# Altium project PM06-底层中央板.PrjPcb
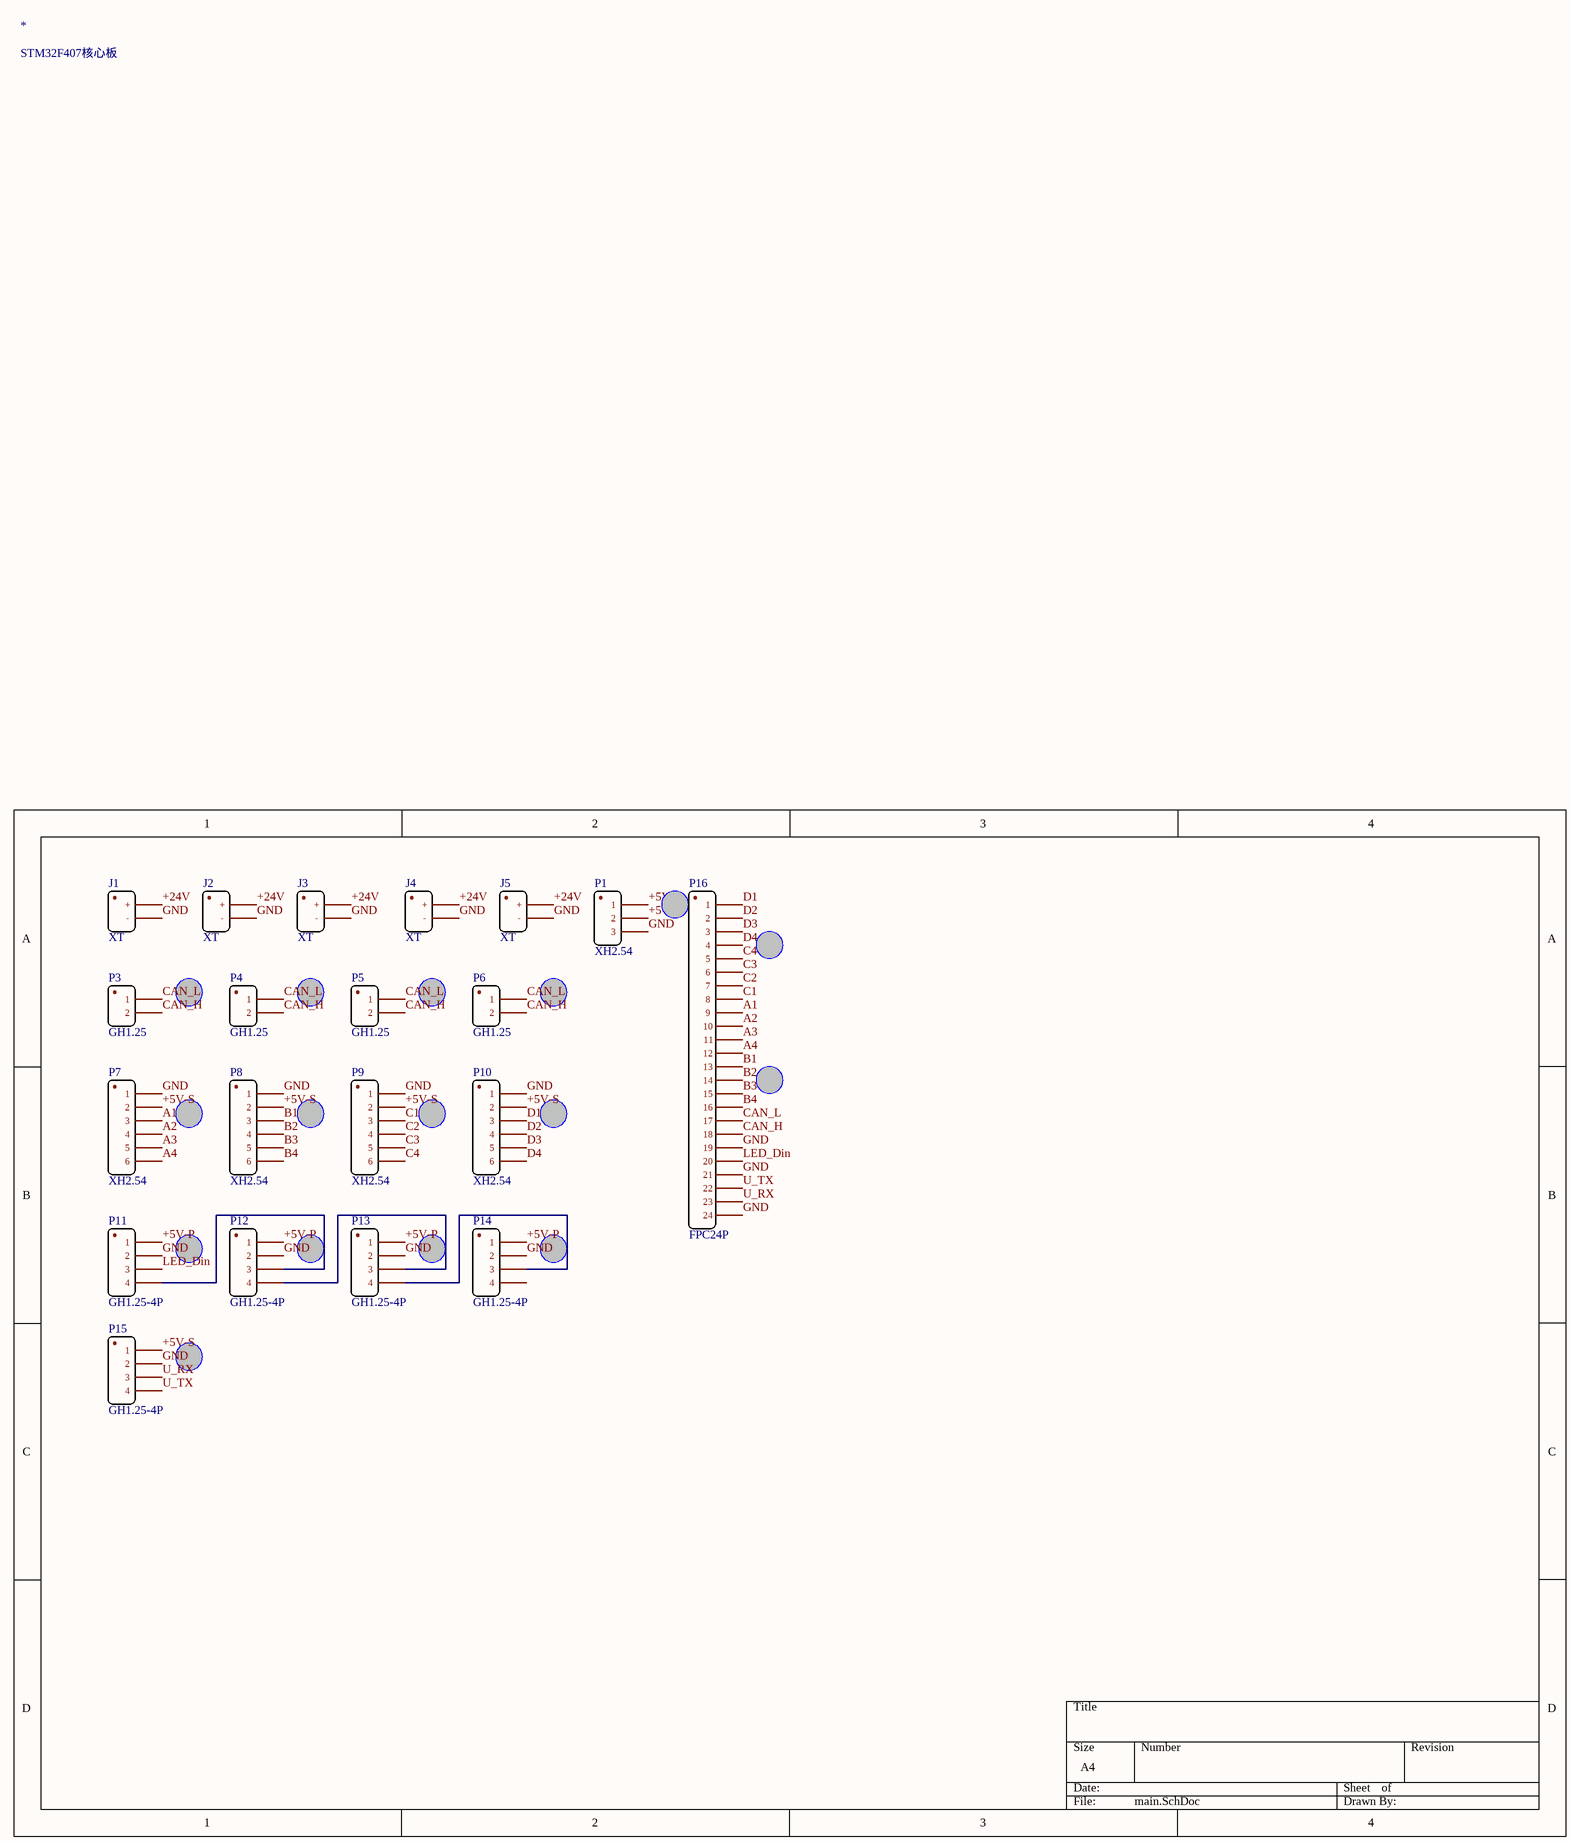
[diagram p0: main.SchDoc]
1 sheet, 21 parts. Net scope: global (net labels, ports and power ports of the same name join across sheets).
Board file: PM06-底层中央板-V1.PcbDoc

## Sheet main.SchDoc
size A4; SheetNumber: 1; SheetTotal: 1

### Parts
*  STM32F407核心板
J1  XT  [XT30-PW-F]
J2  XT  [XT30-PW-F]
J3  XT  [XT30-PW-F]
J4  XT  [XT30-PW-F]
J5  XT  [XT30-PW-M]
P1  XH2.54  [XH2.54-PB-1*3]
P3  GH1.25  [GH1.25-PW-1*2]
P4  GH1.25  [GH1.25-PW-1*2]
P5  GH1.25  [GH1.25-PW-1*2]
P6  GH1.25  [GH1.25-PW-1*2]
P7  XH2.54  [XH2.54_AW_1*6]
P8  XH2.54  [XH2.54_AW_1*6]
P9  XH2.54  [XH2.54_AW_1*6]
P10  XH2.54  [XH2.54_AW_1*6]
P11  GH1.25-4P  [GH1.25-PW-1*4]
P12  GH1.25-4P  [GH1.25-PW-1*4]
P13  GH1.25-4P  [GH1.25-PW-1*4]
P14  GH1.25-4P  [GH1.25-PW-1*4]
P15  GH1.25-4P  [GH1.25-PW-1*4]
P16  FPC24P  [FPC0.5-WT-24P]

### Nets
+5V-P: P1.2 P11.1 P12.1 P13.1 P14.1
+5V-S: P1.1 P7.2 P8.2 P9.2 P10.2 P15.1
+24V: J1.1 J2.1 J3.1 J4.1 J5.1
A1: P7.3 P16.9
A2: P7.4 P16.10
A3: P7.5 P16.11
A4: P7.6 P16.12
B1: P8.3 P16.13
B2: P8.4 P16.14
B3: P8.5 P16.15
B4: P8.6 P16.16
C1: P9.3 P16.8
C2: P9.4 P16.7
C3: P9.5 P16.6
C4: P9.6 P16.5
CAN_H: P3.2 P4.2 P5.2 P6.2 P16.18
CAN_L: P3.1 P4.1 P5.1 P6.1 P16.17
D1: P10.3 P16.1
D2: P10.4 P16.2
D3: P10.5 P16.3
D4: P10.6 P16.4
GND: J1.2 J2.2 J3.2 J4.2 J5.2 P1.3 P7.1 P8.1 P9.1 P10.1 P11.2 P12.2 P13.2 P14.2 P15.2 P16.19 P16.21 P16.24
LED_Din: P11.3 P16.20
U_RX: P15.3 P16.23
U_TX: P15.4 P16.22
NetP11_4: P11.4 P12.3
NetP12_4: P12.4 P13.3
NetP13_4: P13.4 P14.3

Not connected (* = marked no-connect by the designer): P14 4

### Notes on the sheet
- (in symbol 接口_XT) +; -

### Library data of the parts
J1-J5 = 接口_XT
P1 = 接插件1*3
P3-P6 = 接插件1*2
P7-P10 = 接插件1*6
P11-P15 = 接插件1*4
P16 = 接插件1*24